# EAGLE design PWM (EAGLE 9.3.1)
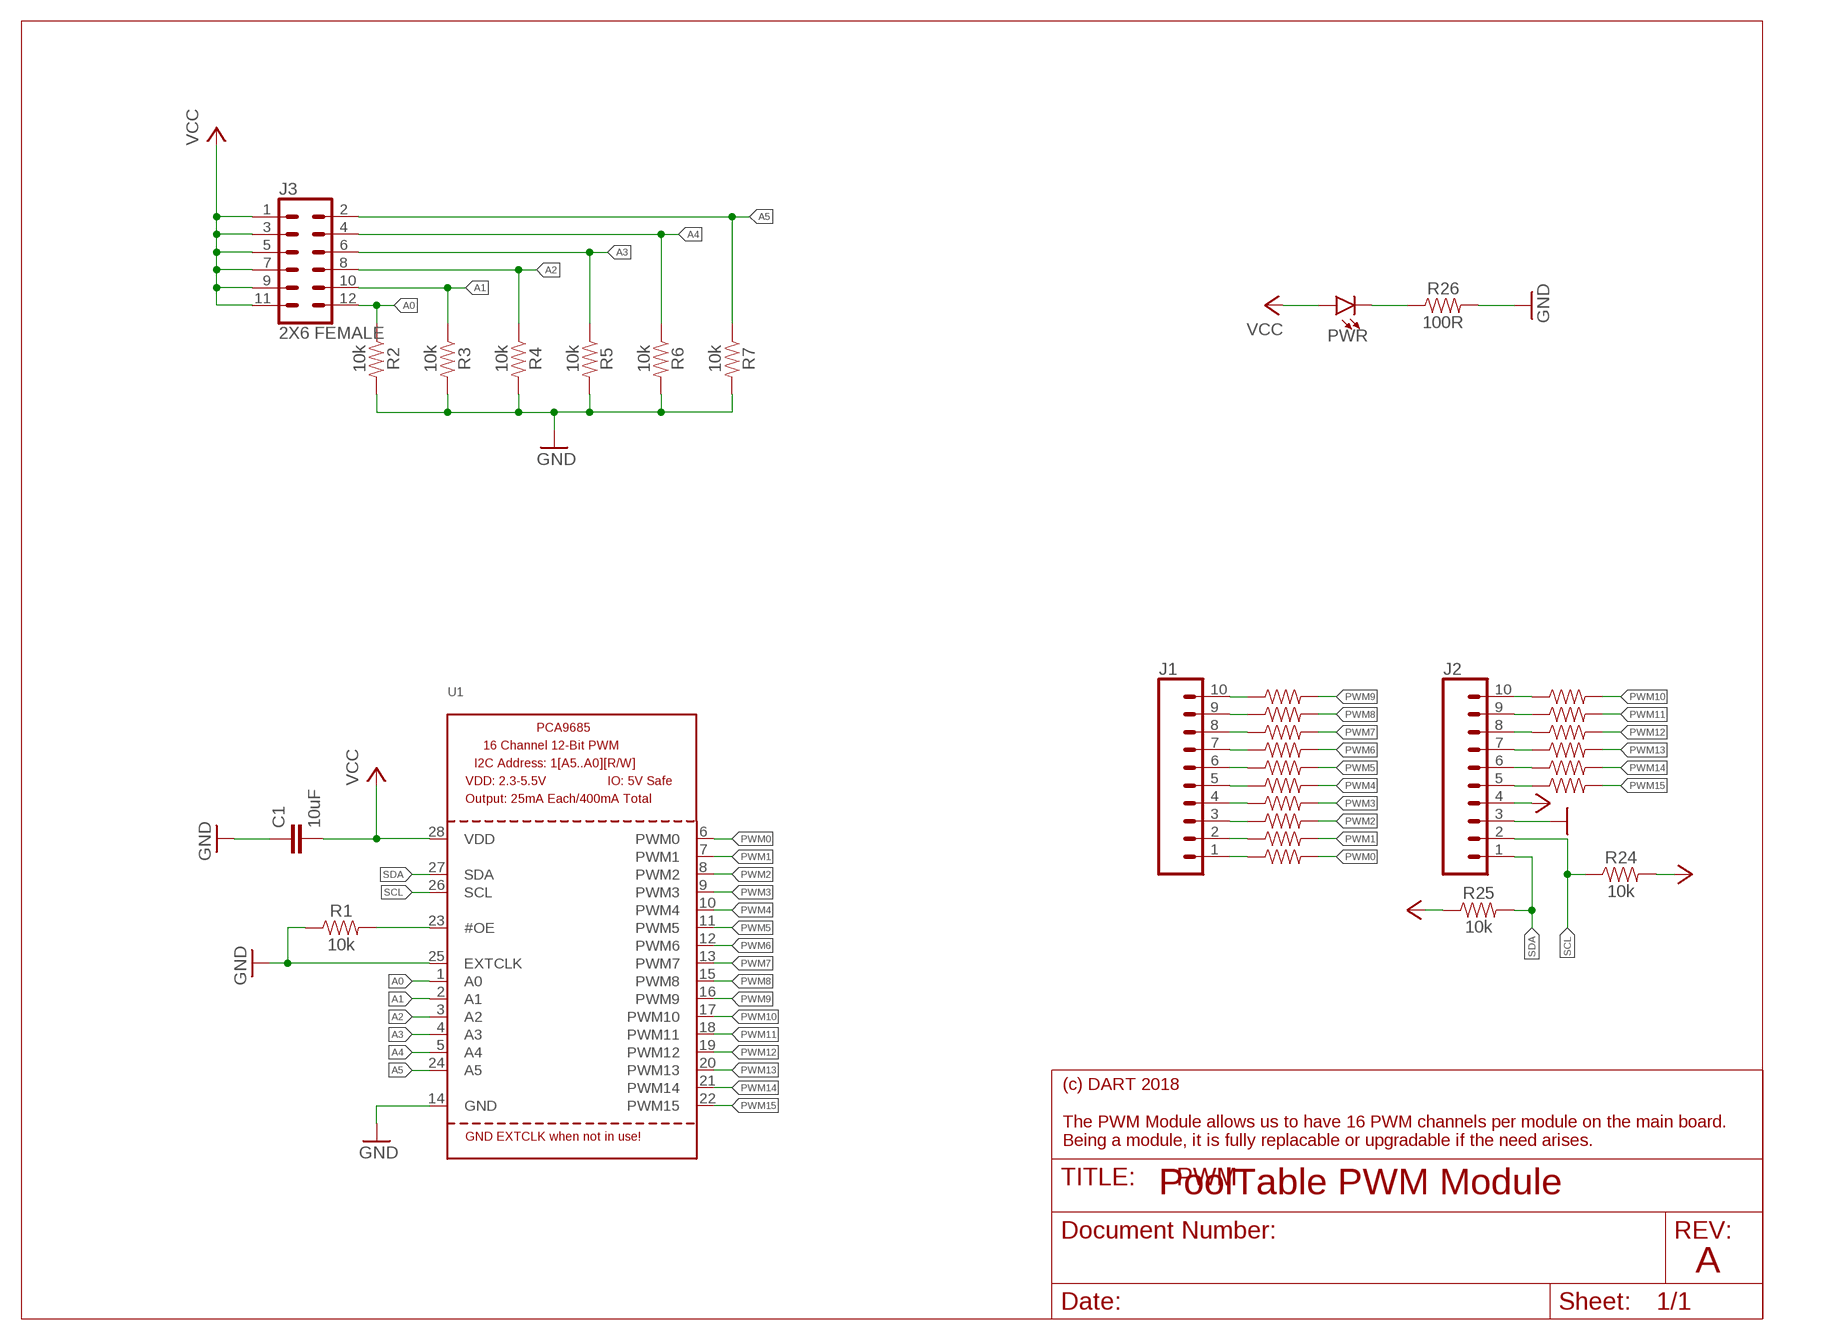
[diagram p0: schematic, sheet 1]

## Parts
C1  10uF  10UF-0603-6.3V-20%  [0603]
J1  CONN_10"  [1X10]
J2  CONN_10"  [1X10]
J3  2X6 FEMALE  CONN_06X2PTH_FEMALE  [2X6]
PWR  LED0603  [LED-0603]
R1  10k  10KOHM-0603-1/10W-1%  [0603]
R2  10k  10KOHM-0603-1/10W-1%  [0603]
R3  10k  10KOHM-0603-1/10W-1%  [0603]
R4  10k  10KOHM-0603-1/10W-1%  [0603]
R5  10k  10KOHM-0603-1/10W-1%  [0603]
R6  10k  10KOHM-0603-1/10W-1%  [0603]
R7  10k  10KOHM-0603-1/10W-1%  [0603]
R8  220  220OHM-0603-1/10W-1%  [0603]
R9  220  220OHM-0603-1/10W-1%  [0603]
R10  220  220OHM-0603-1/10W-1%  [0603]
R11  220  220OHM-0603-1/10W-1%  [0603]
R12  220  220OHM-0603-1/10W-1%  [0603]
R13  220  220OHM-0603-1/10W-1%  [0603]
R14  220  220OHM-0603-1/10W-1%  [0603]
R15  220  220OHM-0603-1/10W-1%  [0603]
R16  220  220OHM-0603-1/10W-1%  [0603]
R17  220  220OHM-0603-1/10W-1%  [0603]
R18  220  220OHM-0603-1/10W-1%  [0603]
R19  220  220OHM-0603-1/10W-1%  [0603]
R20  220  220OHM-0603-1/10W-1%  [0603]
R21  220  220OHM-0603-1/10W-1%  [0603]
R22  220  220OHM-0603-1/10W-1%  [0603]
R23  220  220OHM-0603-1/10W-1%  [0603]
R24  10k  10KOHM-0603-1/10W-1%  [0603]
R25  10k  10KOHM-0603-1/10W-1%  [0603]
R26  100R  470OHM-0603-1/10W-1%  [0603]
U1  PCA9685  [TSSOP28]

## Nets
A0: J3.12 R2.1 U1.1(A0)
A1: J3.10 R3.1 U1.2(A1)
A2: J3.8 R4.1 U1.3(A2)
A3: J3.6 R5.1 U1.4(A3)
A4: J3.4 R6.1 U1.5(A4)
A5: J3.2 R7.1 U1.24(A5)
GND: C1.1 J2.3 R1.1 R2.2 R3.2 R4.2 R5.2 R6.2 R7.2 R26.2 U1.14(GND) U1.25(EXTCLK)
N$1: R1.2 U1.23(#OE)
N$2: J1.10 R8.1
N$3: J1.9 R9.1
N$4: J1.8 R10.1
N$5: J1.7 R11.1
N$6: J1.6 R12.1
N$7: J1.5 R13.1
N$8: J1.4 R14.1
N$9: J1.3 R15.1
N$10: J1.2 R16.1
N$11: J1.1 R17.1
N$12: J2.10 R18.1
N$13: J2.9 R19.1
N$14: J2.8 R20.1
N$15: J2.7 R21.1
N$16: J2.6 R22.1
N$17: J2.5 R23.1
N$18: PWR.C R26.1
PWM0: R17.2 U1.6(PWM0)
PWM1: R16.2 U1.7(PWM1)
PWM2: R15.2 U1.8(PWM2)
PWM3: R14.2 U1.9(PWM3)
PWM4: R13.2 U1.10(PWM4)
PWM5: R12.2 U1.11(PWM5)
PWM6: R11.2 U1.12(PWM6)
PWM7: R10.2 U1.13(PWM7)
PWM8: R9.2 U1.15(PWM8)
PWM9: R8.2 U1.16(PWM9)
PWM10: R18.2 U1.17(PWM10)
PWM11: R19.2 U1.18(PWM11)
PWM12: R20.2 U1.19(PWM12)
PWM13: R21.2 U1.20(PWM13)
PWM14: R22.2 U1.21(PWM14)
PWM15: R23.2 U1.22(PWM15)
SCL: J2.2 R24.1 U1.26(SCL)
SDA: J2.1 R25.2 U1.27(SDA)
VCC: C1.2 J2.4 J3.1 J3.3 J3.5 J3.7 J3.9 J3.11 PWR.A R24.2 R25.1 U1.28(VDD)

## Notes on the sheet
- (c) DART 2018
  
  The PWM Module allows us to have 16 PWM channels per module on the main board.
  Being a module, it is fully replacable or upgradable if the need arises.
- PoolTable PWM Module
- A

## Library data of the parts
C1 = SparkFun-Capacitors:10UF: 10.0µF ceramic capacitors A capacitor is a passive two-terminal electrical component used to store electrical energy temporarily in an electric field.; PROD_ID: CAP-11015
J1 J2 = SparkFun-Connectors:CONN_10: Multi connection point. Often used as Generic Header-pin footprint for 0.1 inch spaced/style header connections On any of the 0.1 inch spaced packages, you can populate with these: Break Away Headers - Straight <https://www.sparkfun.com/products/116> (PRT-00116) Break Away Male Headers - Right Angle <https://www.sparkfun.com/products/553> (PRT-00553) Female Headers <https://www.sparkfun.com/products/115> (PRT-00115) Break Away Headers - Machine Pin <https://www.sparkfun.com/products/117> (PRT-00117) Break Away Female Headers - Swiss Machine Pin <https://www.sparkfun.com/products/743> (PRT-00743) Arduino Stackable Header - 10 Pin <https://www.sparkfun.com/products/11376> (PRT-11376) For SCREWTERMINALS and SPRING TERMINALS visit here: Screw Terimnals on SparkFun.com <https://www.sparkfun.com/search/results?term=Screw+Terminals> (5mm/3.5mm/2.54mm spacing) This device is also useful as a general connection point to wire up your design to another part of your project. Our various solder wires solder well into these plated through hole pads. Hook-Up Wire - Assortment (Stranded, 22 AWG) <https://www.sparkfun.com/products/11375> (PRT-11375) Hook-Up Wire - Assortment (Solid Core, 22 AWG) <https://www.sparkfun.com/products/11367> (PRT-11367) View the entire wire category on our website here <https://www.sparkfun.com/categories/141> Special notes: Molex polarized connector foot print use with SKU : PRT-08231 with associated crimp pins and housings. 1MM SMD Version SKU: PRT-10208 NOTES ON THE VARIANTS LOCK and LOCK_LONGPADS... This footprint was designed to help hold the alignment of a through-hole component (i.e. 6-pin header) while soldering it into place. You may notice that each hole has been shifted either up or down by 0.005 of an inch from it's more standard position (which is a perfectly straight line). This slight alteration caused the pins (the squares in the middle) to touch the edges of the holes. Because they are alternating, it causes a "brace" to hold the component in place. 0.005 has proven to be the perfect amount of "off-center" position when using our standard breakaway headers. Although looks a little odd when you look at the bare footprint, once you have a header in there, the alteration is very hard to notice. Also,if you push a header all the way into place, it is covered up entirely on the bottom side.; PROD_ID: CONN-11563
J3 = SparkFun-Connectors:CONN_06X2: Multi connection point. Often used as Generic Header-pin footprint for 0.1 inch spaced/style header connections On any of the 0.1 inch spaced packages, you can populate with these: Break Away Headers - Straight <https://www.sparkfun.com/products/116> (PRT-00116) Break Away Male Headers - Right Angle <https://www.sparkfun.com/products/553> (PRT-00553) Female Headers <https://www.sparkfun.com/products/115> (PRT-00115) Break Away Headers - Machine Pin <https://www.sparkfun.com/products/117> (PRT-00117) Break Away Female Headers - Swiss Machine Pin <https://www.sparkfun.com/products/743> (PRT-00743); PROD_ID: CONN-12423
PWR = SparkFun-LED:LED: LED (Generic) Standard schematic elements and footprints for 5mm, 3mm, 1206, and 0603 sized LEDs. Generic LEDs with no color specified.
R1-R7 R24 R25 = SparkFun-Resistors:10KOHM: 10kΩ resistor A resistor is a passive two-terminal electrical component that implements electrical resistance as a circuit element. Resistors act to reduce current flow, and, at the same time, act to lower voltage levels within circuits. - Wikipedia; PROD_ID: RES-00824
R8-R23 = SparkFun-Resistors:220OHM: 220Ω resistor A resistor is a passive two-terminal electrical component that implements electrical resistance as a circuit element. Resistors act to reduce current flow, and, at the same time, act to lower voltage levels within circuits. - Wikipedia; PROD_ID: RES-07861
R26 = SparkFun-Resistors:470OHM: 470Ω resistor A resistor is a passive two-terminal electrical component that implements electrical resistance as a circuit element. Resistors act to reduce current flow, and, at the same time, act to lower voltage levels within circuits. - Wikipedia; PROD_ID: RES-07869; VALUE: 470
U1 = adafruit:PCA9685: PCA9685 - 16 Channel 12-Bit I2C PWM Controller 5.0V tolerant 16 channel, 12-bit I2C PWM controller with 25mA per output (max. 400mA total) Digikey: 568-5931-1-ND

## Board
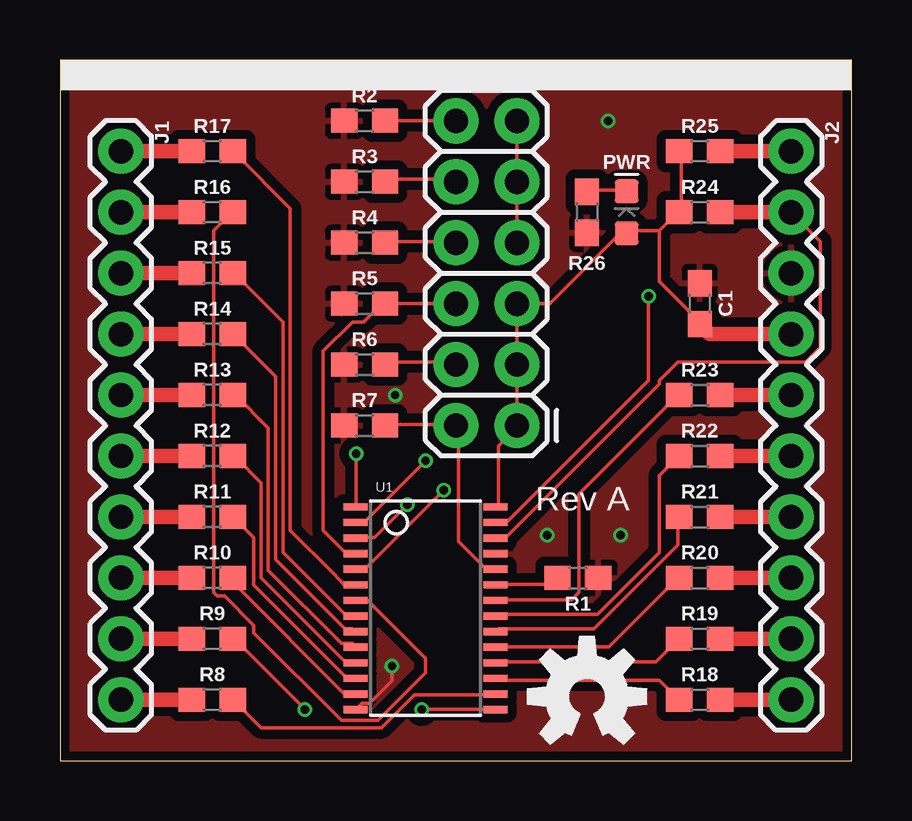
[diagram p1: board, top side]
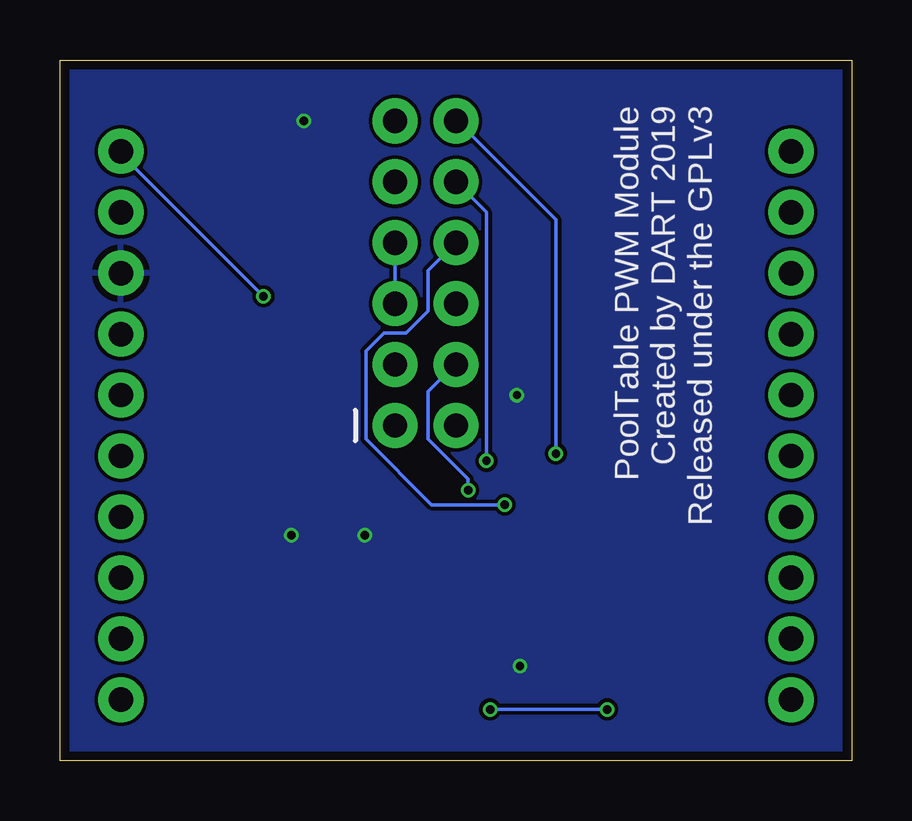
[diagram p2: board, bottom side, seen from below]

Size 33.02 x 29.21 mm. Coordinates in mm from the lower left corner, seen from the top.
Outline: 0,0 33.02,0 33.02,29.21 0,29.21 0,0
Copper layers (1*16): Top 0.035559375mm / dielectric 1.6mm / Bottom 0.035559375mm
Design rules "oshpark-2layer": minimum track width 6mil, minimum drill 10mil, track to track 6mil, track to pad 6mil, pad to pad 6mil, via to via 6mil, smd to smd 6mil, copper to edge 15mil, drill to drill 6mil, minimum pad ring 5mil, minimum via ring 5mil, stop-mask expansion 2.5mil, vias tented up to drill 0mil, thermal gap 10mil

### Footprints (pad centres in the part's own frame; a part is rotated, then mirrored left to right if it is on the bottom)
0603 = smd 1.1 x 1: 1 -0.85,0; 2 0.85,0
1X10 = drill 1.016 pad 1.88: 1 0,0; 2 2.54,0; 3 5.08,0; 4 7.62,0; 5 10.16,0; 6 12.7,0; 7 15.24,0; 8 17.78,0; 9 20.32,0; 10 22.86,0
2X6 = drill 1.016 pad 1.88: 1 0,0; 2 0,2.54; 3 2.54,0; 4 2.54,2.54; 5 5.08,0; 6 5.08,2.54; 7 7.62,0; 8 7.62,2.54; 9 10.16,0; 10 10.16,2.54; 11 12.7,0; 12 12.7,2.54
LED-0603 = smd 1 x 1: A -0.877,0; C 0.877,0
TSSOP28 = smd 0.305 x 0.991: 1 -4.225,-2.918; 2 -3.575,-2.918; 3 -2.925,-2.918; 4 -2.275,-2.918; 5 -1.625,-2.918; 6 -0.975,-2.918; 7 -0.325,-2.918; 8 0.325,-2.918; 9 0.975,-2.918; 10 1.625,-2.918; 11 2.275,-2.918; 12 2.925,-2.918; 13 3.575,-2.918; 14 4.225,-2.918; 15 4.225,2.918; 16 3.575,2.918; 17 2.925,2.918; 18 2.275,2.918; 19 1.625,2.918; 20 0.975,2.918; 21 0.325,2.918; 22 -0.325,2.918; 23 -0.975,2.918; 24 -1.625,2.918; 25 -2.275,2.918; 26 -2.925,2.918; 27 -3.575,2.918; 28 -4.225,2.918

### Placement (x,y rotation side)
C1  26.67,19.05 270 top
J1  2.54,25.4 270 top
J2  30.48,25.4 270 top
J3  19.05,13.97 90 top
PWR  23.62,22.86 90 top
R1  21.59,7.62 180 top
R2  12.7,26.67 180 top
R3  12.7,24.13 180 top
R4  12.7,21.59 180 top
R5  12.7,19.05 180 top
R6  12.7,16.51 180 top
R7  12.7,13.97 180 top
R8  6.35,2.54 0 top
R9  6.35,5.08 0 top
R10  6.35,7.62 0 top
R11  6.35,10.16 0 top
R12  6.35,12.7 0 top
R13  6.35,15.24 0 top
R14  6.35,17.78 0 top
R15  6.35,20.32 0 top
R16  6.35,22.86 0 top
R17  6.35,25.4 0 top
R18  26.67,2.54 180 top
R19  26.67,5.08 180 top
R20  26.67,7.62 180 top
R21  26.67,10.16 180 top
R22  26.67,12.7 180 top
R23  26.67,15.24 180 top
R24  26.67,22.86 180 top
R25  26.67,25.4 0 top
R26  21.97,22.86 270 top
U1  15.24,6.35 270 top
U$1  [OSHW-LOGO-M]  21.97,2.67 0 top

### Tracks (layer width: path | path; a pad name or v marks a point on that pad's centre or on a via)
A0  (via drill 0.35)
  Top 0.152: v12.34,12.8 12.34,10.67 U1.1 | J3.12 R2.1
  Bottom 0.152: v12.34,12.8 12.34,22.55 16.46,26.67 J3.12
A1  (via drill 0.35)
  Top 0.152: v15.24,12.5 12.68,9.93 U1.2 | R3.1 13.56,24.23 16.46,24.23 J3.10
  Bottom 0.152: v15.24,12.5 15.24,22.86 J3.10
A2  (via drill 0.35)
  Top 0.152: v14.48,10.67 13.11,9.3 12.34,9.3 U1.3 | R4.1 13.56,21.64 16.46,21.64 J3.8
  Bottom 0.152: v14.48,10.67 17.53,10.67 20.27,13.41 20.27,17.07 19.51,17.83 18.59,17.83 17.68,18.75 17.68,20.42 J3.8
A3
  Top 0.152: U1.4 12.19,8.69 11.89,8.69 10.97,9.6 10.97,17.07 12.19,18.29 12.65,18.29 13.41,19.05 R5.1 J3.6
A4  (via drill 0.35)
  Top 0.152: U1.5 12.35,7.95 12.68,7.95 v16,11.28 | R6.1 13.56,16.61 16.46,16.61 J3.4
  Bottom 0.152: v16,11.28 16,11.73 17.68,13.41 17.68,15.39 16.61,16.46 J3.4
A5
  Top 0.152: U1.24 18.13,7.95 17.8,7.95 16.61,9.14 16.61,13.87 J3.2 16.46,14.02 13.56,14.02 R7.1
GND  (via drill 0.35)
  Top 0.152: U1.14 12.59,2.39 12.91,2.39 13.84,3.33 v13.84,3.94
  other vias: 13.97,15.24 23.37,9.4 22.86,26.67 20.32,9.4
  pour Top (isolate 0.381): -1.27,30.48 -1.27,-1.27 34.29,-1.27 34.29,30.48
  pour Bottom: -3.81,31.75 -3.81,-3.81 35.56,-3.81 36.83,-3.81 36.83,33.02 -3.81,33.02
N$1
  Top 0.152: U1.23 18.3,7.33 18.29,7.34 20.45,7.34 20.73,7.62 R1.2
N$2
  Top 0.61: R8.1 J1.10
N$3
  Top 0.61: R9.1 J1.9
N$4
  Top 0.61: R10.1 J1.8
N$5
  Top 0.61: R11.1 J1.7
N$6
  Top 0.61: R12.1 J1.6
N$7
  Top 0.61: R13.1 J1.5
N$8
  Top 0.61: R14.1 J1.4
N$9
  Top 0.61: R15.1 J1.3
N$10
  Top 0.61: R16.1 J1.2
N$11
  Top 0.61: R17.1 J1.1
N$12
  Top 0.61: R18.1 J2.10
N$13
  Top 0.61: J2.9 R19.1
N$14
  Top 0.61: R20.1 J2.8
N$15
  Top 0.61: J2.7 R21.1
N$16
  Top 0.61: J2.6 R22.1
N$17
  Top 0.61: J2.5 R23.1
N$18
  Top 0.152: PWR.C 23.62,23.77 22.1,23.77 R26.1
PWM0
  Top 0.152: U1.6 11.84,7.33 11.4,7.8 9.6,9.6 9.6,23.01 7.32,25.3 R17.2
PWM1
  Top 0.152: U1.7 12.83,6.68 15.24,4.27 15.24,3.66 13.26,1.68 11.73,1.68 8.08,5.33 8.08,5.64 6.86,6.86 6.55,6.86 6.4,7.01 6.4,22.1 7.16,22.86 R16.2
PWM2
  Top 0.152: U1.8 12.19,6.1 11.89,6.1 9.3,8.69 9.3,18.29 7.32,20.27 R15.2
PWM3
  Top 0.152: U1.9 12.19,5.49 11.89,5.49 8.99,8.38 8.99,16 7.32,17.68 R14.2
PWM4
  Top 0.152: U1.10 12.19,4.88 11.73,4.88 8.69,7.92 8.69,13.87 7.32,15.24 R13.2
PWM5
  Top 0.152: U1.11 12.19,4.12 11.89,4.12 8.38,7.62 8.38,11.58 7.32,12.65 R12.2
PWM6
  Top 0.152: U1.12 12.19,3.5 11.89,3.5 8.08,7.32 8.08,9.3 7.32,10.06 R11.2
PWM7
  Top 0.152: U1.13 11.86,2.77 7.32,7.32 7.32,7.62 R10.2
PWM8  (via drill 0.35)
  Top 0.152: v15.09,2.13 18.14,2.13 U1.15 | v10.21,2.13 7.32,5.03 R9.2
  Bottom 0.152: v10.21,2.13 v15.09,2.13
PWM9
  Top 0.152: U1.16 18.14,2.74 14.78,2.74 13.41,1.37 8.38,1.37 7.32,2.44 R8.2
PWM10
  Top 0.152: U1.17 18.29,3.35 24.99,3.35 25.76,2.59 R18.2
PWM11
  Top 0.152: U1.18 18.29,4.12 24.84,4.12 25.76,5.03 R19.2
PWM12
  Top 0.152: U1.19 18.23,4.8 18.29,4.75 22.89,4.75 25.76,7.62 R20.2
PWM13
  Top 0.152: U1.20 18.29,5.49 22.25,5.49 25.76,8.99 25.76,10.06 R21.2
PWM14
  Top 0.152: U1.21 18.29,6.1 22.4,6.1 24.99,8.69 24.99,11.89 25.76,12.65 R22.2
PWM15
  Top 0.152: U1.22 18.29,6.71 21.34,6.71 21.64,7.01 21.64,11.12 25.76,15.24 R23.2
SCL
  Top 0.152: J2.2 31.7,21.64 31.7,17.22 31.09,16.61 25.76,16.61 24.99,15.85 24.99,15.7 18.59,9.3 18.29,9.3 U1.26
  Top 0.61: J2.2 R24.1
SDA  (via drill 0.35)
  Top 0.152: v24.54,19.36 24.54,15.85 18.62,9.93 U1.27
  Top 0.61: J2.1 R25.2
  Bottom 0.152: v24.54,19.36 30.48,25.3 J2.1
VCC
  Top 0.152: J3.7 J3.9 J3.11 | 24.99,22.1 23.62,22.1 PWR.A 23.62,21.95 23.32,21.95 20.42,19.05 J3.5 J3.3 J3.1 19.05,13.87 18.29,13.11 18.29,10.67 U1.28 | 24.99,22.1 25.76,22.86 R24.2 25.91,22.86 25.91,25.3 R25.1 | 24.99,22.1 24.99,19.96 26.52,18.44 C1.2
  Top 0.61: J2.4 27.09,17.78 C1.2
  Bottom 0.152: J3.5 J3.7

### Text on the board
tPlace: Rev A
bPlace: PoolTable PWM Module / Created by DART 2019 / Released under the GPLv3